# Altium schematic sheet 外设.SchDoc
size A3
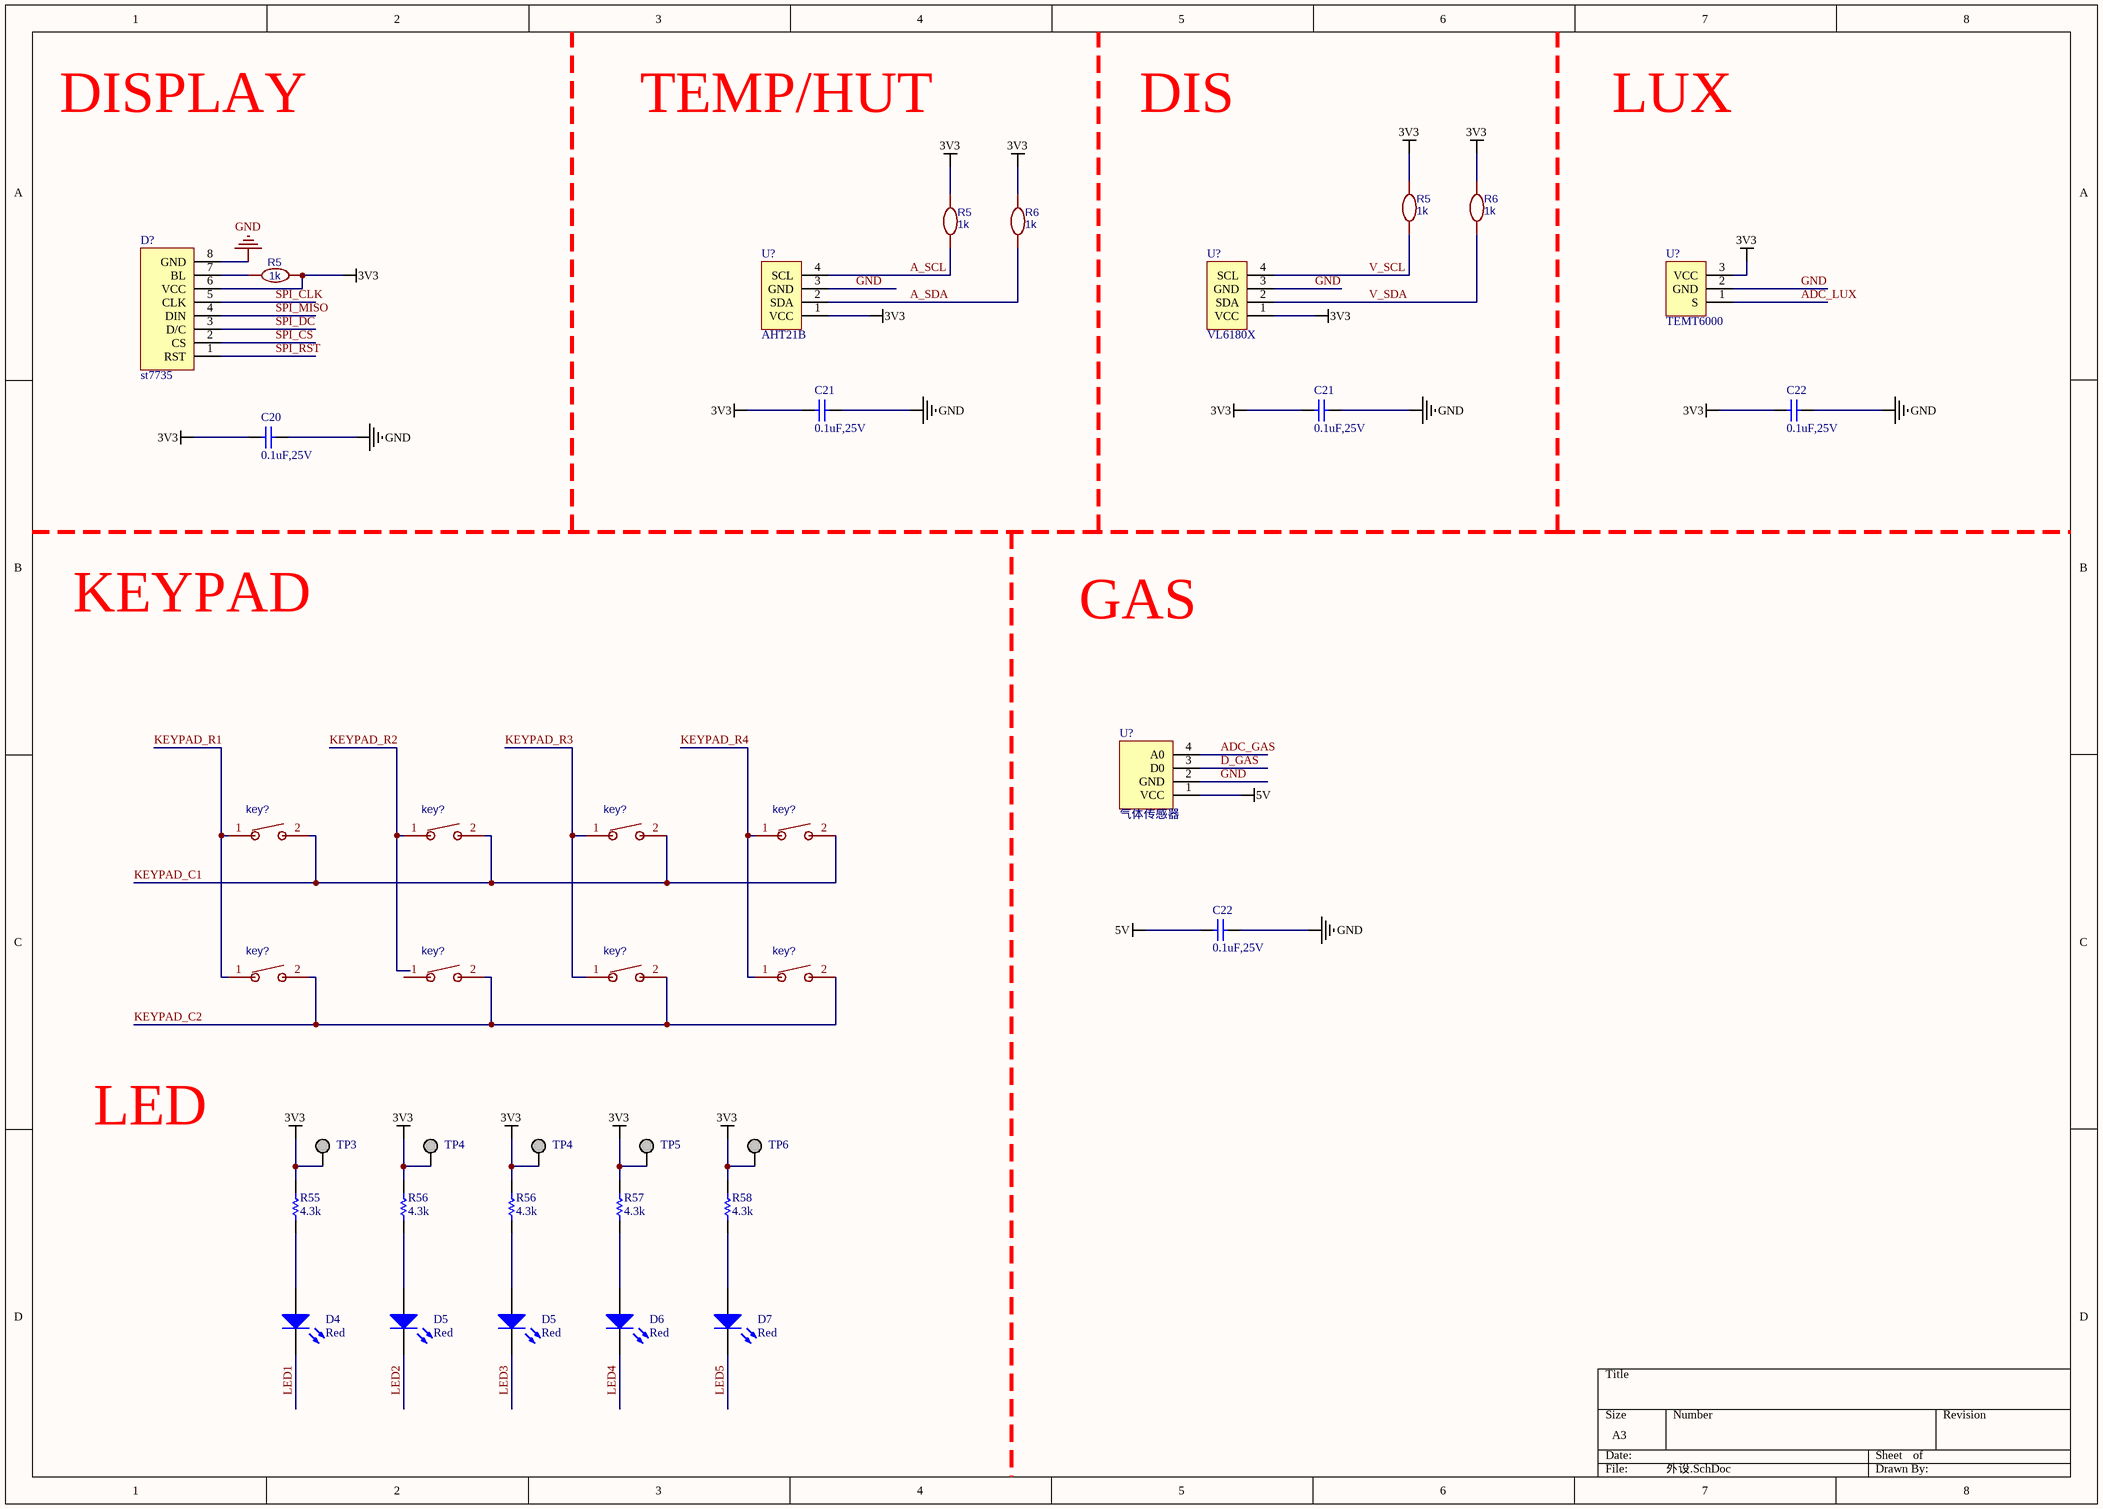
[diagram p0: 外设.SchDoc]

## Parts
(Parts that share a designator on the sheet are numbered #1, #2 ... from top to bottom, then left to right.)
C20  value 0.1uF,25V  [0603_C]  (hidden comment: Cap)
C21#1  value 0.1uF,25V  [0603_C]  (hidden comment: Cap)
C21#2  value 0.1uF,25V  [0603_C]  (hidden comment: Cap)
C22#1  value 0.1uF,25V  [0603_C]  (hidden comment: Cap)
C22#2  value 0.1uF,25V  [0603_C]  (hidden comment: Cap)
D4  value Red  [0805_LED]  (hidden comment: LED)
D5#1  value Red  [0805_LED]  (hidden comment: LED)
D5#2  value Red  [0805_LED]  (hidden comment: LED)
D6  value Red  [0805_LED]  (hidden comment: LED)
D7  value Red  [0805_LED]  (hidden comment: LED)
D?  st7735
key?#1  TSA343G00-250J2  [SW-SMD_L4.0-W2.9-LS5.0]  (value not drawn)
key?#2  TSA343G00-250J2  [SW-SMD_L4.0-W2.9-LS5.0]  (value not drawn)
key?#3  TSA343G00-250J2  [SW-SMD_L4.0-W2.9-LS5.0]  (value not drawn)
key?#4  TSA343G00-250J2  [SW-SMD_L4.0-W2.9-LS5.0]  (value not drawn)
key?#5  TSA343G00-250J2  [SW-SMD_L4.0-W2.9-LS5.0]  (value not drawn)
key?#6  TSA343G00-250J2  [SW-SMD_L4.0-W2.9-LS5.0]  (value not drawn)
key?#7  TSA343G00-250J2  [SW-SMD_L4.0-W2.9-LS5.0]  (value not drawn)
key?#8  TSA343G00-250J2  [SW-SMD_L4.0-W2.9-LS5.0]  (value not drawn)
R5#1  1k  [R0603 NSK]
R5#2  1k  [R0603 NSK]
R5#3  1k  [R0603 NSK]
R6#1  1k  [R0603 NSK]
R6#2  1k  [R0603 NSK]
R55  value 4.3k  [0603_R]  (hidden comment: Res_5%)
R56#1  value 4.3k  [0603_R]  (hidden comment: Res_5%)
R56#2  value 4.3k  [0603_R]  (hidden comment: Res_5%)
R57  value 4.3k  [0603_R]  (hidden comment: Res_5%)
R58  value 4.3k  [0603_R]  (hidden comment: Res_5%)
TP3  TP  [TP_H]  (value not drawn)  (no BOM)
TP4#1  TP  [TP_H]  (value not drawn)  (no BOM)
TP4#2  TP  [TP_H]  (value not drawn)  (no BOM)
TP5  TP  [TP_H]  (value not drawn)  (no BOM)
TP6  TP  [TP_H]  (value not drawn)  (no BOM)
U?#1  AHT21B
U?#2  VL6180X
U?#3  TEMT6000
U?#4  气体传感器

## Nets
3V3: C20.2 C21#1.2 C21#2.2 C22#1.2 D?.6(VCC) R5#1.2 R5#2.2 R5#3.2 R6#1.2 R6#2.2 R55.2 R56#1.2 R56#2.2 R57.2 R58.2 TP3.1 TP4#1.1 TP4#2.1 TP5.1 TP6.1 U?#1.1(VCC) U?#2.1(VCC) U?#3.3(VCC)
5V: C22#2.2 U?#4.1(VCC)
GND: C20.1 C21#1.1 C21#2.1 C22#1.1 C22#2.1 D?.8(GND) U?#1.3(GND) U?#2.3(GND) U?#3.2(GND) U?#4.2(GND)
A_SCL: R5#2.1 U?#1.4(SCL)
A_SDA: R6#2.1 U?#1.2(SDA)
ADC_GAS: U?#4.4(A0)
ADC_LUX: U?#3.1(S)
D_GAS: U?#4.3(D0)
KEYPAD_C1: key?#1.2 key?#2.2 key?#3.2 key?#4.2
KEYPAD_C2: key?#5.2 key?#6.2 key?#7.2 key?#8.2
KEYPAD_R1: key?#1.1 key?#5.1
KEYPAD_R2: key?#2.1
KEYPAD_R3: key?#3.1 key?#7.1
KEYPAD_R4: key?#4.1 key?#8.1
LED1: D4.2(K)
LED2: D5#1.2(K)
LED3: D5#2.2(K)
LED4: D6.2(K)
LED5: D7.2(K)
SPI_CLK: D?.5(CLK)
SPI_CS: D?.2(CS)
SPI_DC: D?.3(D/C)
SPI_MISO: D?.4(DIN)
SPI_RST: D?.1(RST)
V_SCL: R5#1.1 U?#2.4(SCL)
V_SDA: R6#1.1 U?#2.2(SDA)
NetD4_1: D4.1(A) R55.1
NetD5#1_1: D5#1.1(A) R56#1.1
NetD5#2_1: D5#2.1(A) R56#2.1
NetD6_1: D6.1(A) R57.1
NetD7_1: D7.1(A) R58.1
NetD?_7: D?.7(BL) R5#3.1

Not connected (* = marked no-connect by the designer): key?#6 1

## Notes on the sheet
- DISPLAY
- TEMP/HUT
- DIS
- LUX
- KEYPAD
- GAS
- LED

## Library data of the parts
C20 C21#1 C21#2 C22#1 C22#2 = T_Cap_0603_0.1uF_25V_X5R: 贴片电容; Part Typer: X5R; Solder: SMD; Withstand Voltage: 25V; Tolerance: 10%; Schematic Path: X:\Database\Schematic Library.Schlib; Part Number: T_Cap_0603_0.1uF_25V_X5R; LibRef: T_Cap_0603_0.1uF_25V_X5R
D4 D5#1 D5#2 D6 D7 = T_LED_Red_0805: 红色LED灯; Solder: SMD; Schematic Path: X:\Database\Schematic Library.Schlib; Part Number: T_LED_Red_0805; LibRef: T_LED_Red_0805
key?#1-key?#8 = TSA343G00-250J2: BOM_Manufacturer: BRIGHT; Contributor: LCSC; BOM_Supplier: LCSC; BOM_Supplier Part: C354946; BOM_Manufacturer Part: TSA343G00-250J2; BOM_JLCPCB Part Class: Extended Part; spicePre: S; spiceSymbolName: TSA343G00-250J2
R5#1-R5#3 R6#1 R6#2 = 1k: nameAlias: Value(Ω); Contributor: LCEDA_Lib; spicePre: R; spiceSymbolName: R_0603_EU
R55 R56#1 R56#2 R57 R58 = T_Res_0603_4.3k_5%_1/10W: 贴片电阻; Solder: SMD; Power: 1/10W; Tolerance: 5%; Schematic Path: X:\Database\Schematic Library.Schlib; Part Number: T_Res_0603_4.3k_5%_1/10W; LibRef: T_Res_0603_4.3k_5%_1/10W
TP3 TP4#1 TP4#2 TP5 TP6 = T_TestPoint_H: 测试点_过孔; Solder: DIP; Schematic Path: X:\Database\Schematic Library.Schlib; Part Number: T_TestPoint_H; LibRef: T_TestPoint_H
U?#4 = MQ135